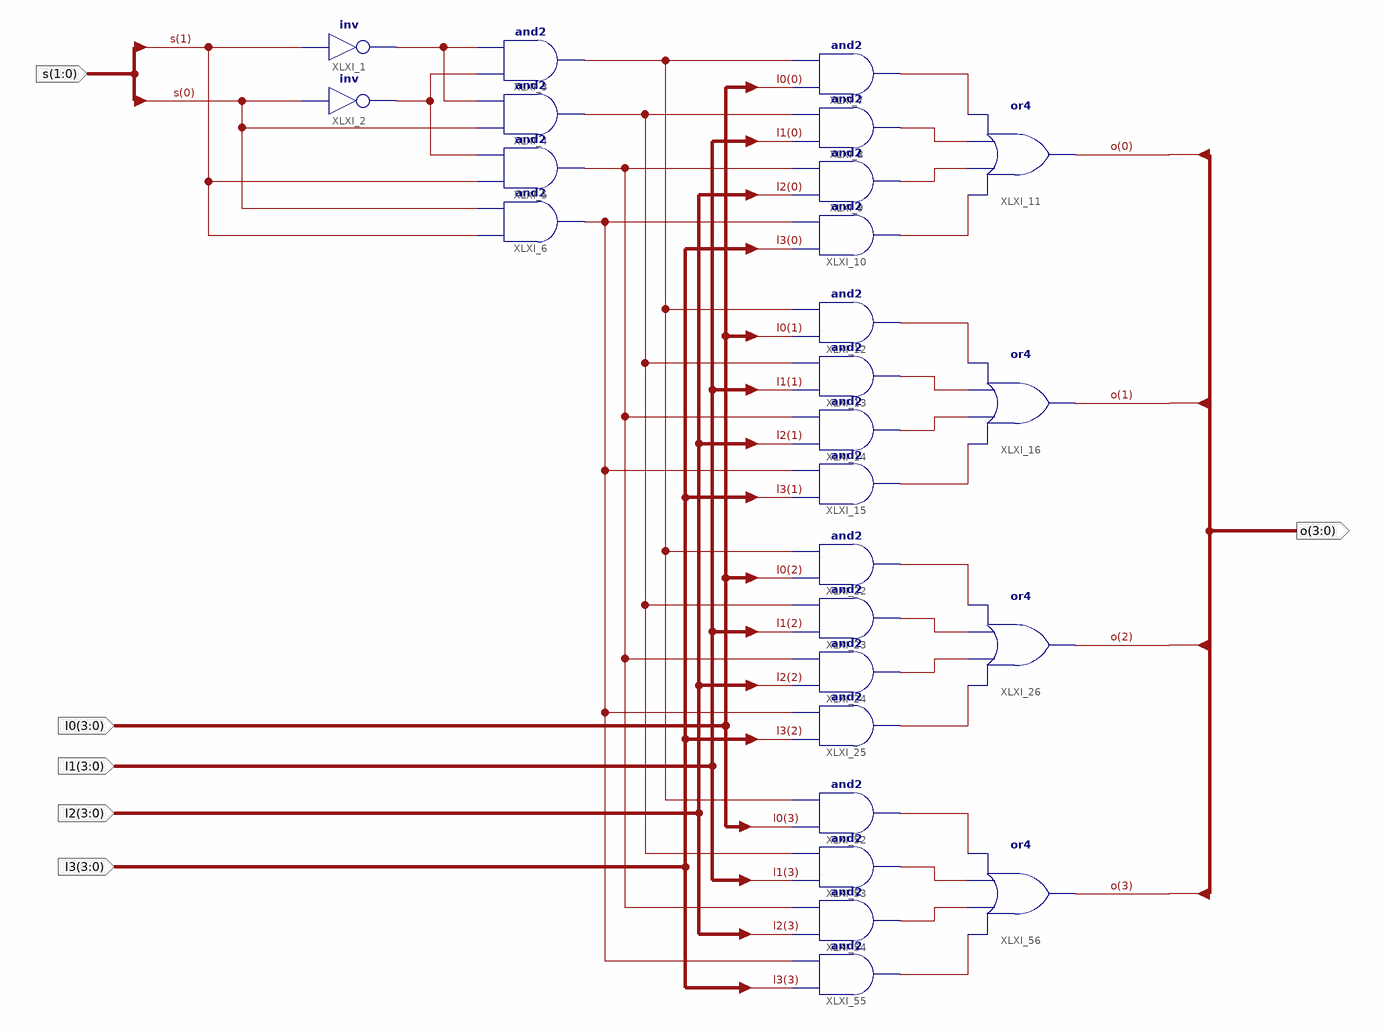
[diagram p0: schematic sheet 1]
// Xilinx ISE schematic Mux4to1b4_sch.sch (kintex7) as structural Verilog: 26 symbols, 6 ports
module Mux4to1b4_sch (
  input  [1:0] s,
  input  [3:0] l1,
  input  [3:0] l0,
  input  [3:0] l2,
  input  [3:0] l3,
  output [3:0] o
);

  wire XLXN_5, XLXN_6, XLXN_11, XLXN_12, XLXN_13, XLXN_14, XLXN_15, XLXN_16, XLXN_17, XLXN_18, XLXN_23,
       XLXN_24, XLXN_25, XLXN_26, XLXN_47, XLXN_48, XLXN_49, XLXN_50, XLXN_55, XLXN_57, XLXN_58, XLXN_59;

  not XLXI_1 (XLXN_5, s[1]);
  not XLXI_2 (XLXN_6, s[0]);
  and XLXI_3 (XLXN_55, XLXN_6, XLXN_5);
  and XLXI_4 (XLXN_57, s[0], XLXN_5);
  and XLXI_5 (XLXN_58, s[1], XLXN_6);
  and XLXI_6 (XLXN_59, s[1], s[0]);
  and XLXI_7 (XLXN_11, l0[0], XLXN_55);
  and XLXI_8 (XLXN_12, l1[0], XLXN_57);
  and XLXI_9 (XLXN_13, l2[0], XLXN_58);
  and XLXI_10 (XLXN_14, l3[0], XLXN_59);
  or XLXI_11 (o[0], XLXN_14, XLXN_13, XLXN_12, XLXN_11);
  and XLXI_12 (XLXN_15, l0[1], XLXN_55);
  and XLXI_13 (XLXN_16, l1[1], XLXN_57);
  and XLXI_14 (XLXN_17, l2[1], XLXN_58);
  and XLXI_15 (XLXN_18, l3[1], XLXN_59);
  or XLXI_16 (o[1], XLXN_18, XLXN_17, XLXN_16, XLXN_15);
  and XLXI_22 (XLXN_23, l0[2], XLXN_55);
  and XLXI_23 (XLXN_24, l1[2], XLXN_57);
  and XLXI_24 (XLXN_25, l2[2], XLXN_58);
  and XLXI_25 (XLXN_26, l3[2], XLXN_59);
  or XLXI_26 (o[2], XLXN_26, XLXN_25, XLXN_24, XLXN_23);
  and XLXI_52 (XLXN_47, l0[3], XLXN_55);
  and XLXI_53 (XLXN_48, l1[3], XLXN_57);
  and XLXI_54 (XLXN_49, l2[3], XLXN_58);
  and XLXI_55 (XLXN_50, l3[3], XLXN_59);
  or XLXI_56 (o[3], XLXN_50, XLXN_49, XLXN_48, XLXN_47);
endmodule
